# Altium schematic sheet mother1.SchDoc
size A4
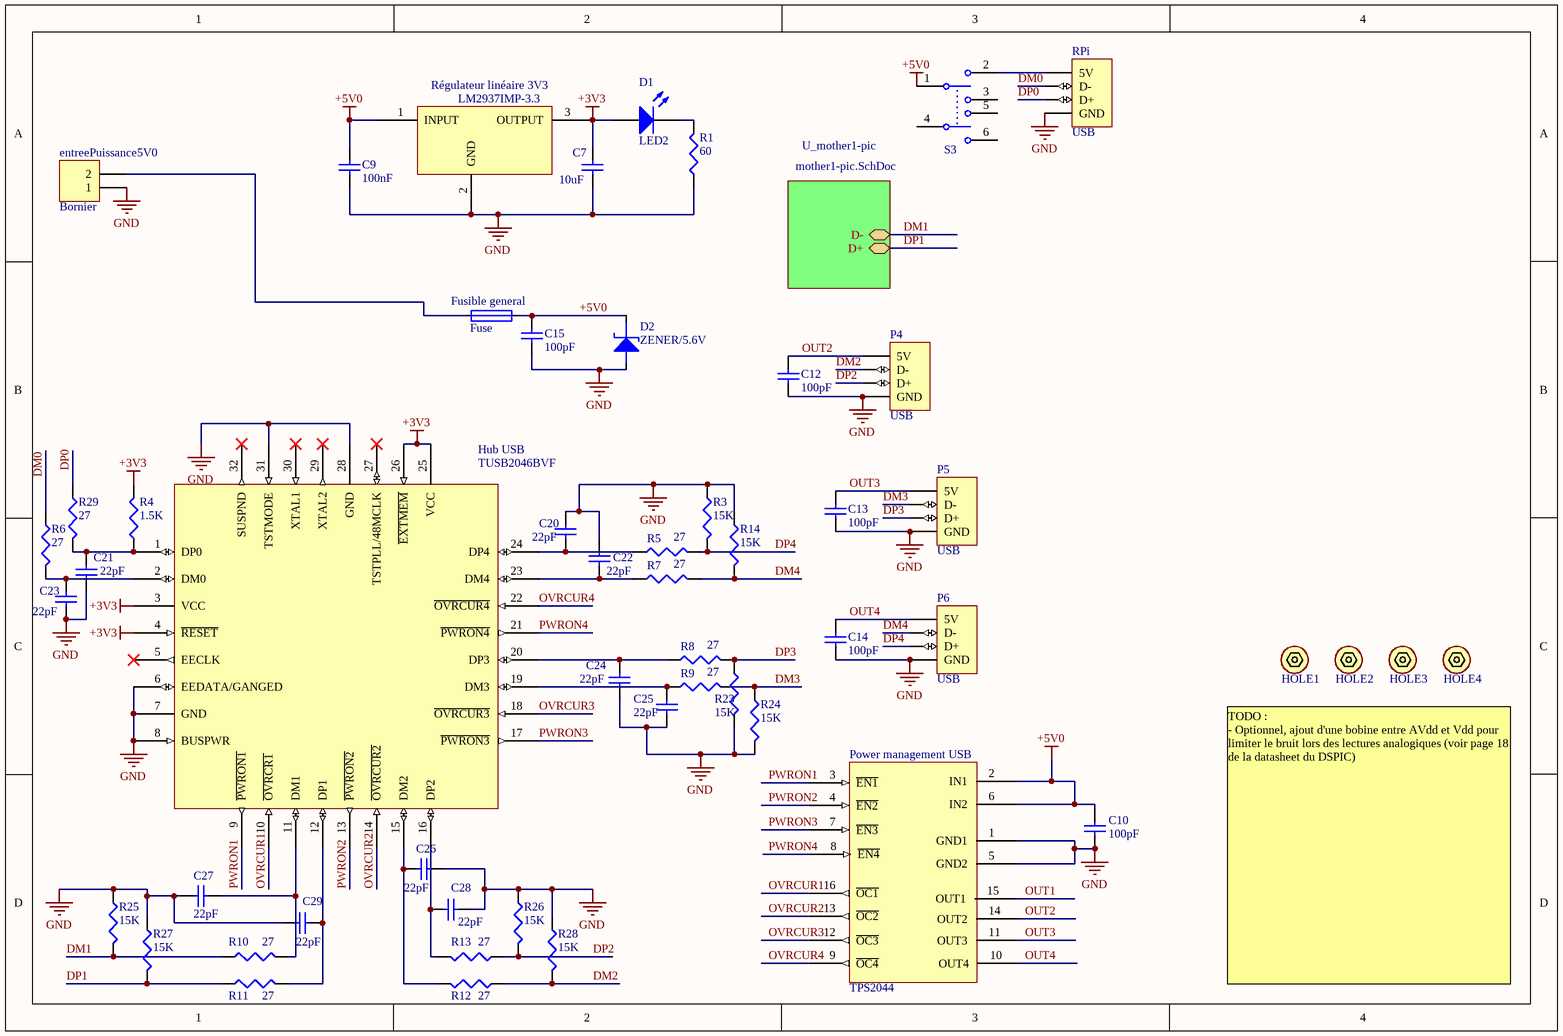
[diagram p0: mother1.SchDoc]

## Parts
C7  value 10uF  [C0805C]  (hidden comment: CAP)
C9  value 100nF  [C0805C]  (hidden comment: CAP)
C10  value 100pF  [C0805C]  (hidden comment: CAP)
C12  value 100pF  [C0805C]  (hidden comment: CAP)
C13  value 100pF  [C0805C]  (hidden comment: CAP)
C14  value 100pF  [C0805C]  (hidden comment: CAP)
C15  value 100pF  [C0805C]  (hidden comment: CAP)
C20  value 22pF  [C0805C]  (hidden comment: CAP)
C21  value 22pF  [C0805C]  (hidden comment: CAP)
C22  value 22pF  [C0805C]  (hidden comment: CAP)
C23  value 22pF  [C0805C]  (hidden comment: CAP)
C24  value 22pF  [C0805C]  (hidden comment: CAP)
C25  value 22pF  [C0805C]  (hidden comment: CAP)
C26  value 22pF  [C0805C]  (hidden comment: CAP)
C27  value 22pF  [C0805C]  (hidden comment: CAP)
C28  value 22pF  [C0805C]  (hidden comment: CAP)
C29  value 22pF  [C0805C]  (hidden comment: CAP)
D1  LED2  [LED1206G]
D2  ZENER/5.6V  [DSO-C2/X1.8]
entreePuissance5V0  Bornier  [Bornier male coude 2 voies]
Fusible_general  Fuse  [Fuse Holder 5x20mm]
HOLE1  Hole  [SCREW]  (value not drawn)
HOLE2  Hole  [SCREW]  (value not drawn)
HOLE3  Hole  [SCREW]  (value not drawn)
HOLE4  Hole  [SCREW]  (value not drawn)
Hub_USB  TUSB2046BVF  [TUSB2046BVF]
P4  USB  [USB SM female vertical]
P5  USB  [USB SM female vertical]
P6  USB  [USB SM female vertical]
Power_management_USB  TPS2044  [TPS2044]
R1  value 60  [C0805R]  (hidden comment: RES)
R3  value 15K  [C0805R]  (hidden comment: RES)
R4  value 1.5K  [C0805R]  (hidden comment: RES)
R5  value 27  [C0805R]  (hidden comment: RES)
R6  value 27  [C0805R]  (hidden comment: RES)
R7  value 27  [C0805R]  (hidden comment: RES)
R8  value 27  [C0805R]  (hidden comment: RES)
R9  value 27  [C0805R]  (hidden comment: RES)
R10  value 27  [C0805R]  (hidden comment: RES)
R11  value 27  [C0805R]  (hidden comment: RES)
R12  value 27  [C0805R]  (hidden comment: RES)
R13  value 27  [C0805R]  (hidden comment: RES)
R14  value 15K  [C0805R]  (hidden comment: RES)
R23  value 15K  [C0805R]  (hidden comment: RES)
R24  value 15K  [C0805R]  (hidden comment: RES)
R25  value 15K  [C0805R]  (hidden comment: RES)
R26  value 15K  [C0805R]  (hidden comment: RES)
R27  value 15K  [C0805R]  (hidden comment: RES)
R28  value 15K  [C0805R]  (hidden comment: RES)
R29  value 27  [C0805R]  (hidden comment: RES)
RPi  USB  [USB SM2.5 Male]
Régulateur_linéaire_3V3  LM2937IMP-3.3  [SOT223]
S3  SW-DPDT/Reset  [MCLSS22]  (value not drawn)

## Sub-sheets
U_mother1-pic = mother1-pic.SchDoc: D- (bidir), D+ (bidir)

## Nets
+3V3: C7.2 D1.1(A) Hub_USB.3(VCC) Hub_USB.4(~{RESET}) Hub_USB.25(VCC) Hub_USB.26(~{EXTMEM}) R4.2 Régulateur_linéaire_3V3.3(OUTPUT)
+5V0: C9.1 C10.1 C15.2 D2.K Fusible_general.2 Power_management_USB.2(IN1) Power_management_USB.6(IN2) Régulateur_linéaire_3V3.1(INPUT) S3.1
GND: C7.1 C9.2 C10.2 C12.1 C13.1 C14.1 C15.1 C20.2 C21.2 C22.2 C23.2 C24.1 C25.1 C26.1 C27.2 C28.1 C29.1 D2.A entreePuissance5V0.1 Hub_USB.6(EEDATA/GANGED) Hub_USB.7(GND) Hub_USB.8(BUSPWR) Hub_USB.28(GND) Hub_USB.31(TSTMODE) P4.4(GND) P5.4(GND) P6.4(GND) Power_management_USB.1(GND1) Power_management_USB.5(GND2) R1.1 R3.1 R14.1 R23.2 R24.2 R25.1 R26.1 R27.1 R28.1 RPi.4(GND) Régulateur_linéaire_3V3.2(GND)
DM0: R6.1 RPi.2(D-)
DM1: R10.1 R25.2 ; sheet U_mother1-pic/D-
DM2: P4.2(D-) R12.1 R28.2
DM3: P5.2(D-) R9.2 R24.1
DM4: P6.2(D-) R7.2 R14.2
DP0: R29.1 RPi.3(D+)
DP1: R11.1 R27.2 ; sheet U_mother1-pic/D+
DP2: P4.3(D+) R13.1 R26.2
DP3: P5.3(D+) R8.2 R23.1
DP4: P6.3(D+) R3.2 R5.2
OUT1: Power_management_USB.15(OUT1)
OUT2: C12.2 P4.1(5V) Power_management_USB.14(OUT2)
OUT3: C13.2 P5.1(5V) Power_management_USB.11(OUT3)
OUT4: C14.2 P6.1(5V) Power_management_USB.10(OUT4)
OVRCUR1: Hub_USB.10(~{OVRCR1}) Power_management_USB.16(~{OC1})
OVRCUR2: Hub_USB.14(~{OVRCUR2}) Power_management_USB.13(~{OC2})
OVRCUR3: Hub_USB.18(~{OVRCUR3}) Power_management_USB.12(~{OC3})
OVRCUR4: Hub_USB.22(~{OVRCUR4}) Power_management_USB.9(~{OC4})
PWRON1: Hub_USB.9(~{PWRON1}) Power_management_USB.3(~{EN1})
PWRON2: Hub_USB.13(~{PWRON2}) Power_management_USB.4(~{EN2})
PWRON3: Hub_USB.17(~{PWRON3}) Power_management_USB.7(~{EN3})
PWRON4: Hub_USB.21(~{PWRON4}) Power_management_USB.8(~{EN4})
NetC20_1: C20.1 Hub_USB.24(DP4) R5.1
NetC21_1: C21.1 Hub_USB.1(DP0) R4.1 R29.2
NetC22_1: C22.1 Hub_USB.23(DM4) R7.1
NetC23_1: C23.1 Hub_USB.2(DM0) R6.2
NetC24_2: C24.2 Hub_USB.20(DP3) R8.1
NetC25_2: C25.2 Hub_USB.19(DM3) R9.1
NetC26_2: C26.2 Hub_USB.15(DM2) R12.2
NetC27_1: C27.1 Hub_USB.11(DM1) R10.2
NetC28_2: C28.2 Hub_USB.16(DP2) R13.2
NetC29_2: C29.2 Hub_USB.12(DP1) R11.2
NetD1_2: D1.2(K) R1.2
NetentreePuissance5V0_2: entreePuissance5V0.2 Fusible_general.1
NetRPi_1: RPi.1(5V) S3.2

Not connected (* = marked no-connect by the designer): HOLE1 1(Hole); HOLE2 1(Hole); HOLE3 1(Hole); HOLE4 1(Hole); Hub_USB 5(EECLK)* 27(TSTPLL/48MCLK)* 29(XTAL2)* 30(XTAL1)* 32(SUSPND)*; S3 3 4 5 6

## Notes on the sheet
- TODO :
  - Optionnel, ajout d'une bobine entre AVdd et Vdd pour limiter le bruit lors des lectures analogiques (voir page 18 de la datasheet du DSPIC)

## Library data of the parts
C7 C9 C10 C12-C15 C20-C29 = CAP: Capacitor; Published: 8-Jun-2000; LatestRevisionDate: 29-May-2009; LatestRevisionNote: IPC-7351 Footprint Added.; PackageReference: C1206; Publisher: Altium Limited; PackageDescription: Chip Capacitor
D1 = LED2: Typical RED, GREEN, YELLOW, AMBER GaAs LED; Published: 8-Jun-2000; LatestRevisionDate: 17-Jul-2002; LatestRevisionNote: Re-released for DXP Platform.; PackageVersion: Feb-2002; PackageReference: 3.2X1.6X1.1; Publisher: Altium Limited; PackageDescription: SM LED; 2 Flat Leads
D2 = ZENER
entreePuissance5V0 = Header 2: Header, 2-Pin; LatestRevisionDate: 17-Jul-2002; LatestRevisionNote: Re-released for DXP Platform.; Publisher: Altium Limited
HOLE1-HOLE4 = Hole: Mounting Hole for screws
Hub_USB = TUSB2046BVF: TI 4-Port USB Hub
P4-P6 RPi = USB Con: USB Connector; LatestRevisionDate: 17-Jul-2002; LatestRevisionNote: Re-released for DXP Platform.; Publisher: Altium Limited
Power_management_USB = TPS2044: Power distribution USB
R1 R3-R14 R23-R29 = RES: Resistor; Published: 8-Jun-2000; LatestRevisionDate: 29-May-2009; LatestRevisionNote: IPC-7351 Footprint Added.; PackageReference: J1-0603; Publisher: Altium Limited; PackageDescription: Chip Resistor
Régulateur_linéaire_3V3 = LM2937IMP-3.3: 500 mA Low Dropout Regulator
S3 = SW-DPDT: Double-Pole, Double-Throw Switch, ref MCLSS22; Published: 24-Mar-1999; LatestRevisionDate: 17-Jul-2002; LatestRevisionNote: Re-released for DXP Platform.; PackageReference: DPDT-6; Publisher: Altium Limited; PackageDescription: Switch; 6 Leads